# Altium schematic sheet Sheet2.SchDoc
size A4
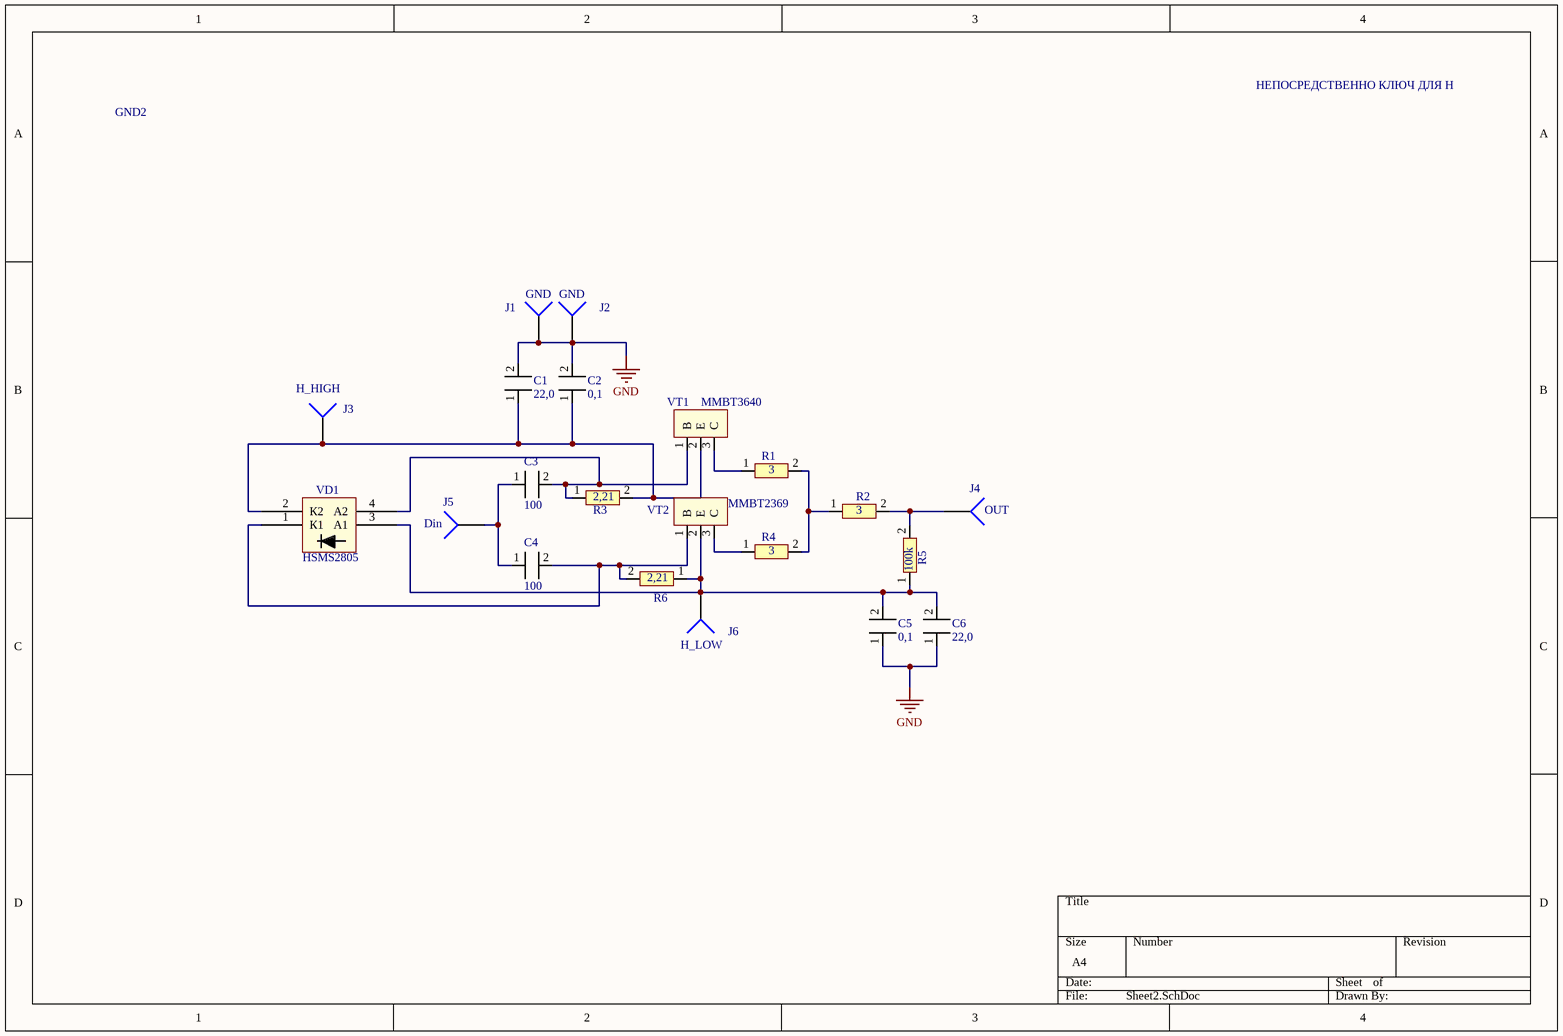
[diagram p0: Sheet2.SchDoc]

## Parts
C1  22,0  [Cap_BIG]
C2  0,1  [CAP_SMALL]
C3  100  [CAP_SMALL]
C4  100  [CAP_SMALL]
C5  0,1  [CAP_SMALL]
C6  22,0  [Cap_BIG]
J1  GND  [PIN1]
J2  GND  [PIN1]
J3  H_HIGH  [PIN1]
J4  OUT  [PIN1]
J5  Din  [PIN1]
J6  H_LOW  [PIN1]
R1  3  [RES]
R2  3  [RES]
R3  2,21  [RES]
R4  3  [RES]
R5  100k  [RES]
R6  2,21  [RES]
VD1  HSMS2805  [SOT-143B]
VT1  MMBT3640  [SOT23-BEC_MMBT3640*(Primary)]
VT2  MMBT2369  [SOT23-BEC_MMBT3640*(Primary)]

## Nets
GND: C1.2 C2.2 C5.1 C6.1 J1.1 J2.1
NetC1_1: C1.1 C2.1 J3.1 R3.2 VD1.2(К2) VT1.2(E)
NetC3_1: C3.1 C4.1 J5.1
NetC3_2: C3.2 R3.1 VD1.4(А2) VT1.1(B)
NetC4_2: C4.2 R6.2 VD1.1(К1) VT2.1(B)
NetC5_2: C5.2 C6.2 J6.1 R5.1 R6.1 VD1.3(А1) VT2.2(E)
NetJ4_1: J4.1 R2.2 R5.2
NetR1_1: R1.1 VT1.3(C)
NetR1_2: R1.2 R2.1 R4.2
NetR4_1: R4.1 VT2.3(C)

## Notes on the sheet
- GND2
- НЕПОСРЕДСТВЕННО КЛЮЧ ДЛЯ H

## Library data of the parts
C1 C6 = CAP_BIG
C2-C5 = CAP_SMALL
J1-J6 = Socket: LatestRevisionDate: 17-Jul-2002; LatestRevisionNote: Re-released for DXP Platform.; Publisher: Altium Limited
R1-R6 = RES
VD1 = HSMS-2805